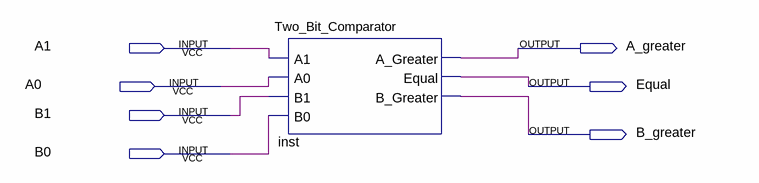
[diagram p0: schematic sheet]
// Quartus schematic Block.bdf as structural Verilog: 1 symbols, 7 pins
module Block (
  input  A1,
  input  A0,
  input  B1,
  input  B0,
  output A_greater,
  output Equal,
  output B_greater
);

  Two_Bit_Comparator inst (
    .A1(A1), .A0(A0), .B1(B1), .B0(B0), .A_Greater(A_greater), .Equal(Equal), .B_Greater(B_greater));
endmodule
